# Altium schematic sheet al115v20_ac.SchDoc
size A4; DrawnBy: Suraj K A; Engineer: Suraj K A; Organization: Simcons Control Systems; Address1: HMT Colony PO; Address2: Kalamassery; Address3: Cochin; Address4: India
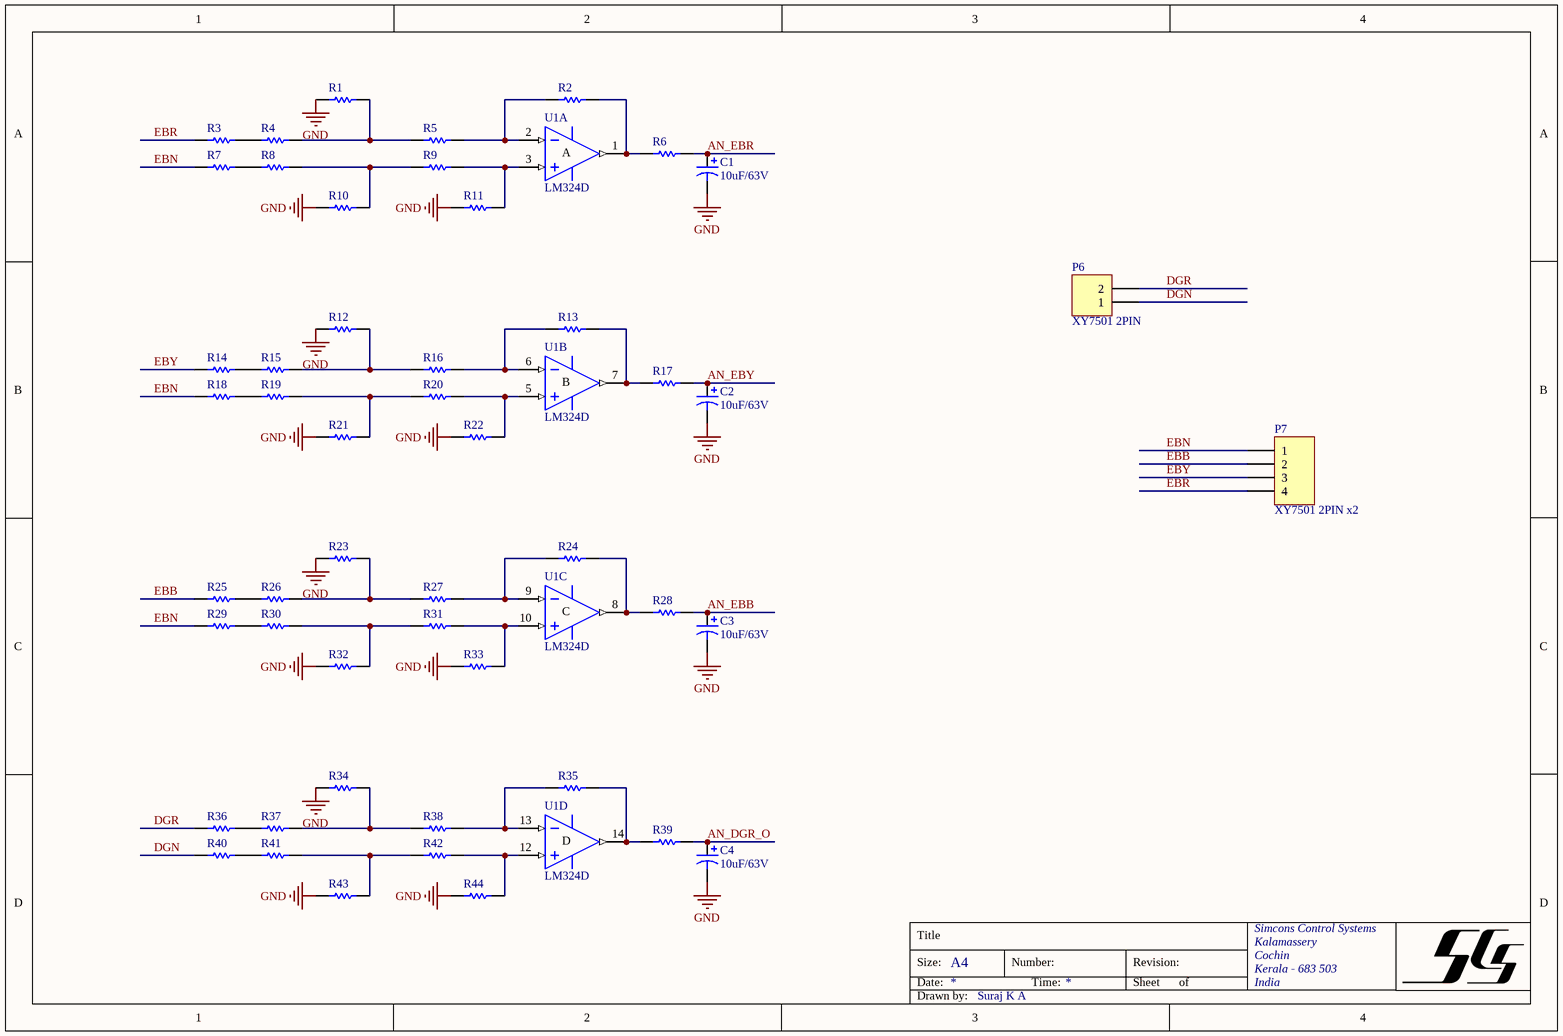
[diagram p0: al115v20_ac.SchDoc]

## Parts
C1  value 10uF/63V  [C1206]  (hidden comment: 1uF 1206)
C2  value 10uF/63V  [C1206]  (hidden comment: 1uF 1206)
C3  value 10uF/63V  [C1206]  (hidden comment: 1uF 1206)
C4  value 10uF/63V  [C1206]  (hidden comment: 1uF 1206)
P6  XY7501 2PIN  [XY7501_7.62_2PIN]
P7  XY7501 2PIN x2  [XY7501_7.62_4PIN]
R1  4.7K 1206  [R1206]  (value not drawn)
R2  1M 1206  [R1206]  (value not drawn)
R3  MFR 1M .5W  [AXIAL-0.5]  (value not drawn)
R4  MFR 1M .5W  [AXIAL-0.5]  (value not drawn)
R5  220K 1206  [R1206]  (value not drawn)
R6  470K 1206  [R1206]  (value not drawn)
R7  MFR 1M .5W  [AXIAL-0.5]  (value not drawn)
R8  MFR 1M .5W  [AXIAL-0.5]  (value not drawn)
R9  220K 1206  [R1206]  (value not drawn)
R10  4.7K 1206  [R1206]  (value not drawn)
R11  1M 1206  [R1206]  (value not drawn)
R12  4.7K 1206  [R1206]  (value not drawn)
R13  1M 1206  [R1206]  (value not drawn)
R14  MFR 1M .5W  [AXIAL-0.5]  (value not drawn)
R15  MFR 1M .5W  [AXIAL-0.5]  (value not drawn)
R16  220K 1206  [R1206]  (value not drawn)
R17  470K 1206  [R1206]  (value not drawn)
R18  MFR 1M .5W  [AXIAL-0.5]  (value not drawn)
R19  MFR 1M .5W  [AXIAL-0.5]  (value not drawn)
R20  220K 1206  [R1206]  (value not drawn)
R21  4.7K 1206  [R1206]  (value not drawn)
R22  1M 1206  [R1206]  (value not drawn)
R23  4.7K 1206  [R1206]  (value not drawn)
R24  1M 1206  [R1206]  (value not drawn)
R25  MFR 1M .5W  [AXIAL-0.5]  (value not drawn)
R26  MFR 1M .5W  [AXIAL-0.5]  (value not drawn)
R27  220K 1206  [R1206]  (value not drawn)
R28  470K 1206  [R1206]  (value not drawn)
R29  MFR 1M .5W  [AXIAL-0.5]  (value not drawn)
R30  MFR 1M .5W  [AXIAL-0.5]  (value not drawn)
R31  220K 1206  [R1206]  (value not drawn)
R32  4.7K 1206  [R1206]  (value not drawn)
R33  1M 1206  [R1206]  (value not drawn)
R34  4.7K 1206  [R1206]  (value not drawn)
R35  1M 1206  [R1206]  (value not drawn)
R36  MFR 1M .5W  [AXIAL-0.5]  (value not drawn)
R37  MFR 1M .5W  [AXIAL-0.5]  (value not drawn)
R38  220K 1206  [R1206]  (value not drawn)
R39  470K 1206  [R1206]  (value not drawn)
R40  MFR 1M .5W  [AXIAL-0.5]  (value not drawn)
R41  MFR 1M .5W  [AXIAL-0.5]  (value not drawn)
R42  220K 1206  [R1206]  (value not drawn)
R43  4.7K 1206  [R1206]  (value not drawn)
R44  1M 1206  [R1206]  (value not drawn)
U1  LM324D  [SOIC14_M]  (parts A,B,C,D of 4)

## Nets
GND: C1.2 C2.2 C3.2 C4.2 R1.2 R10.2 R11.2 R12.2 R21.2 R22.2 R23.2 R32.2 R33.2 R34.2 R43.2 R44.2 U1.11(V-)
VCC: U1.4(V+)
AN_DGR_O: C4.1 R39.1
AN_EBB: C3.1 R28.1
AN_EBR: C1.1 R6.1
AN_EBY: C2.1 R17.1
DGN: P6.1 R40.1
DGR: P6.2 R36.1
EBB: P7.2 R25.1
EBN: P7.1 R7.1 R18.1 R29.1
EBR: P7.4 R3.1
EBY: P7.3 R14.1
NetR1_1: R1.1 R4.2 R5.2
NetR2_1: R2.1 R6.2 U1.1(OUT)
NetR2_2: R2.2 R5.1 U1.2(IN-)
NetR3_2: R3.2 R4.1
NetR7_2: R7.2 R8.1
NetR8_2: R8.2 R9.2 R10.1
NetR9_1: R9.1 R11.1 U1.3(IN+)
NetR12_1: R12.1 R15.2 R16.2
NetR13_1: R13.1 R17.2 U1.7(OUT)
NetR13_2: R13.2 R16.1 U1.6(IN-)
NetR14_2: R14.2 R15.1
NetR18_2: R18.2 R19.1
NetR19_2: R19.2 R20.2 R21.1
NetR20_1: R20.1 R22.1 U1.5(IN+)
NetR23_1: R23.1 R26.2 R27.2
NetR24_1: R24.1 R28.2 U1.8(OUT)
NetR24_2: R24.2 R27.1 U1.9(IN-)
NetR25_2: R25.2 R26.1
NetR29_2: R29.2 R30.1
NetR30_2: R30.2 R31.2 R32.1
NetR31_1: R31.1 R33.1 U1.10(IN+)
NetR34_1: R34.1 R37.2 R38.2
NetR35_1: R35.1 R39.2 U1.14(OUT)
NetR35_2: R35.2 R38.1 U1.13(IN-)
NetR36_2: R36.2 R37.1
NetR40_2: R40.2 R41.1
NetR41_2: R41.2 R42.2 R43.1
NetR42_1: R42.1 R44.1 U1.12(IN+)

## Notes on the sheet
- Title
- Size:
- Date:
- A4
- Number:
- Time:
- Revision:
- Sheet
- of
- Simcons Control Systems
- Kalamassery
- Cochin
- Kerala - 683 503
- India
- Drawn by:
- (in symbol LM324D, part A) A
- (in symbol LM324D, part B) B
- (in symbol LM324D, part C) C
- (in symbol LM324D, part D) D

## Library data of the parts
C1-C4 = Cap Pol1: Polarized Capacitor (Radial); Published: 8-Jun-2000; LatestRevisionDate: 17-Jul-2002; LatestRevisionNote: Re-released for DXP Platform.; PackageReference: RB7.6-15; Publisher: Altium Limited; PackageDescription: Polarized Capacitor (Radial); 2 Leads
P6 = Header 2: Header, 2-Pin; LatestRevisionDate: 17-Jul-2002; LatestRevisionNote: Re-released for DXP Platform.; Publisher: Altium Limited
P7 = Header 4: Header, 4-Pin; LatestRevisionDate: 17-Jul-2002; LatestRevisionNote: Re-released for DXP Platform.; Publisher: Altium Limited
R1-R5 R7-R16 R18-R27 R29-R38 R40-R44 = Res Semi: Semiconductor Resistor; Published: 8-Jun-2000; LatestRevisionDate: 17-Jul-2002; LatestRevisionNote: Re-released for DXP Platform.; PackageReference: AXIAL-0.5; Publisher: Altium Limited; PackageDescription: Axial Device, Thru-Hole; 2 Leads; 0.5 in Pin Spacing
  R1 R10 R12 R21 R23 R32 R34 R43: Value: 4.7K
  R2-R4 R7 R8 R11 R13-R15 R18 R19 R22 R24-R26 R29 R30 R33 R35-R37 R40 R41 R44: Value: 1M
  R5 R9 R16 R20 R27 R31 R38 R42: Value: 220K
R6 R17 R28 R39 = Res Semi: Semiconductor Resistor; Value: 33K; Published: 8-Jun-2000; LatestRevisionDate: 17-Jul-2002; LatestRevisionNote: Re-released for DXP Platform.; PackageReference: AXIAL-0.5; Publisher: Altium Limited; PackageDescription: Axial Device, Thru-Hole; 2 Leads; 0.5 in Pin Spacing
U1 = LM324D: Quadruple Operational Amplifier; Published: 16-Jan-2001; LatestRevisionDate: 13-Apr-2006; LatestRevisionNote: IPC-7351 Footprint Added.; DatasheetVersion: Feb-1997; PackageVersion: Jan-1998; PackageReference: D014; Publisher: Altium Limited; PackageDescription: 14-Pin Small Outline Integrated Circuit 1.27 mm Pitch; Code_IPC: SOIC127P600-14; ComponentLink1Description: Manufacturer Link; ComponentLink1URL: http://www.ti.com/; ComponentLink2Description: Datasheet; ComponentLink2URL: http://www-s.ti.com/sc/ds/lm324.pdf